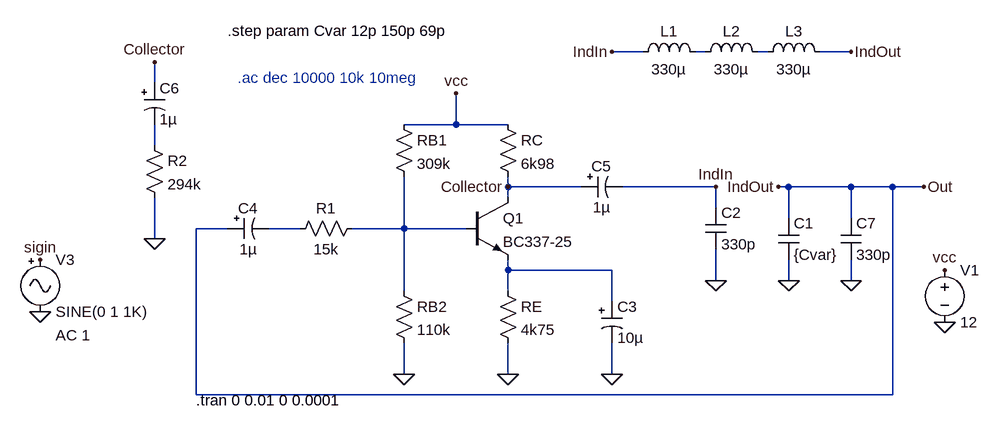
[diagram p0: schematic FixedPointOscilator.asc]
FixedPointOscilator.asc, the LTspice schematic file:
Version 4
SHEET 1 880 680
WIRE 224 -96 176 -96
WIRE 320 -96 304 -96
WIRE 416 -96 400 -96
WIRE 544 -96 496 -96
WIRE -528 -48 -528 -80
WIRE -64 16 -64 -32
WIRE -64 16 -144 16
WIRE 16 16 -64 16
WIRE -528 48 -528 16
WIRE 16 112 16 96
WIRE 128 112 16 112
WIRE 336 112 192 112
WIRE 448 112 432 112
WIRE 544 112 448 112
WIRE 608 112 544 112
WIRE 656 112 608 112
WIRE 16 128 16 112
WIRE 336 144 336 112
WIRE 448 160 448 112
WIRE 544 160 544 112
WIRE -416 176 -464 176
WIRE -304 176 -352 176
WIRE -144 176 -144 96
WIRE -144 176 -224 176
WIRE -48 176 -144 176
WIRE -528 192 -528 128
WIRE 16 240 16 224
WIRE 176 240 16 240
WIRE 336 256 336 208
WIRE 448 256 448 224
WIRE 544 256 544 224
WIRE -144 272 -144 176
WIRE 16 272 16 240
WIRE 176 288 176 240
WIRE -144 400 -144 352
WIRE 16 400 16 352
WIRE 176 400 176 352
WIRE -464 432 -464 176
WIRE 608 432 608 112
WIRE 608 432 -464 432
FLAG -64 -32 vcc
FLAG 688 240 vcc
FLAG 688 320 0
FLAG 336 256 0
FLAG 176 400 0
FLAG 16 400 0
FLAG -144 400 0
FLAG -528 192 0
FLAG 336 112 IndIn
FLAG 432 112 IndOut
FLAG 176 -96 IndIn
FLAG 544 -96 IndOut
FLAG 544 256 0
FLAG 16 112 Collector
FLAG 448 256 0
FLAG -704 224 sigin
FLAG -704 304 0
FLAG 656 112 Out
FLAG -528 -80 Collector
SYMBOL res -160 0 R0
SYMATTR InstName RB1
SYMATTR Value 309k
SYMBOL res 0 0 R0
SYMATTR InstName RC
SYMATTR Value 6k98
SYMBOL res 0 256 R0
SYMATTR InstName RE
SYMATTR Value 4k75
SYMBOL res -160 256 R0
SYMATTR InstName RB2
SYMATTR Value 110k
SYMBOL cap 320 144 R0
SYMATTR InstName C2
SYMATTR Value 330p
SYMBOL polcap 160 288 R0
SYMATTR InstName C3
SYMATTR Value 10µ
SYMBOL voltage 688 224 R0
WINDOW 123 0 0 Left 0
WINDOW 39 0 0 Left 0
SYMATTR InstName V1
SYMATTR Value 12
SYMBOL npn -48 128 R0
SYMATTR InstName Q1
SYMATTR Value BC337-25
SYMBOL res -208 160 R90
WINDOW 0 0 56 VBottom 2
WINDOW 3 32 56 VTop 2
SYMATTR InstName R1
SYMATTR Value 15k
SYMBOL polcap -544 -48 R0
SYMATTR InstName C6
SYMATTR Value 1µ
SYMBOL res -544 32 R0
SYMATTR InstName R2
SYMATTR Value 294k
SYMBOL polcap 128 96 M90
WINDOW 0 0 32 VBottom 2
WINDOW 3 32 32 VTop 2
SYMATTR InstName C5
SYMATTR Value 1µ
SYMBOL polcap -416 160 M90
WINDOW 0 0 32 VBottom 2
WINDOW 3 32 32 VTop 2
SYMATTR InstName C4
SYMATTR Value 1µ
SYMBOL ind 208 -80 R270
WINDOW 0 32 56 VTop 2
WINDOW 3 5 56 VBottom 2
SYMATTR InstName L1
SYMATTR Value 330µ
SYMBOL ind 304 -80 R270
WINDOW 0 32 56 VTop 2
WINDOW 3 5 56 VBottom 2
SYMATTR InstName L2
SYMATTR Value 330µ
SYMBOL ind 400 -80 R270
WINDOW 0 32 56 VTop 2
WINDOW 3 5 56 VBottom 2
SYMATTR InstName L3
SYMATTR Value 330µ
SYMBOL cap 528 160 R0
SYMATTR InstName C7
SYMATTR Value 330p
SYMBOL cap 432 160 R0
SYMATTR InstName C1
SYMATTR Value {Cvar}
SYMBOL Misc\\signal -704 208 R0
WINDOW 123 24 132 Left 2
WINDOW 39 0 0 Left 0
SYMATTR Value2 AC 1
SYMATTR InstName V3
TEXT -464 440 Left 2 !.tran 0 0.01 0 0.0001
TEXT -416 -128 Left 2 !.step param Cvar 12p 150p 69p
TEXT -400 -56 Left 2 ;.ac dec 10000 10k 10meg

The netlist it stands for:
* FixedPointOscilator.asc
RB1 vcc N005 309k
RC vcc Collector 6k98
RE N006 0 4k75
RB2 N005 0 110k
C2 IndIn 0 330p
C3 N006 0 10µ
V1 vcc 0 12
Q1 Collector N005 N006 0 BC337-25
R1 N005 N004 15k
C6 Collector N003 1µ
R2 N003 0 294k
C5 Collector IndIn 1µ
C4 Out N004 1µ
L1 IndIn N001 330µ
L2 N001 N002 330µ
L3 N002 Out 330µ
C7 Out 0 330p
C1 Out 0 {Cvar}
V3 sigin 0 SINE(0 1 1K) AC 1
.model NPN NPN
.model PNP PNP
.lib standard.bjt
.tran 0 0.01 0 0.0001
.step param Cvar 12p 150p 69p
* .ac dec 10000 10k 10meg
.backanno
.end